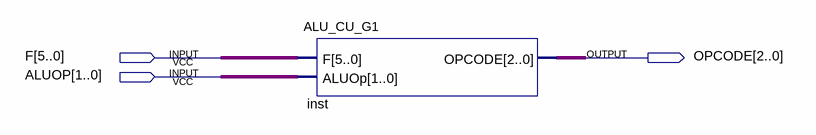
[diagram p0: schematic sheet]
// Quartus schematic ALUCUTEST.bdf as structural Verilog: 1 symbols, 3 pins
module ALUCUTEST (
  input  [5:0] F,
  input  [1:0] ALUOP,
  output [2:0] OPCODE
);

  ALU_CU_G1 inst (.F(F), .ALUOp(ALUOP), .OPCODE(OPCODE));
endmodule
